# Altium project AC Measure Monitor Senso Board.PrjPcb
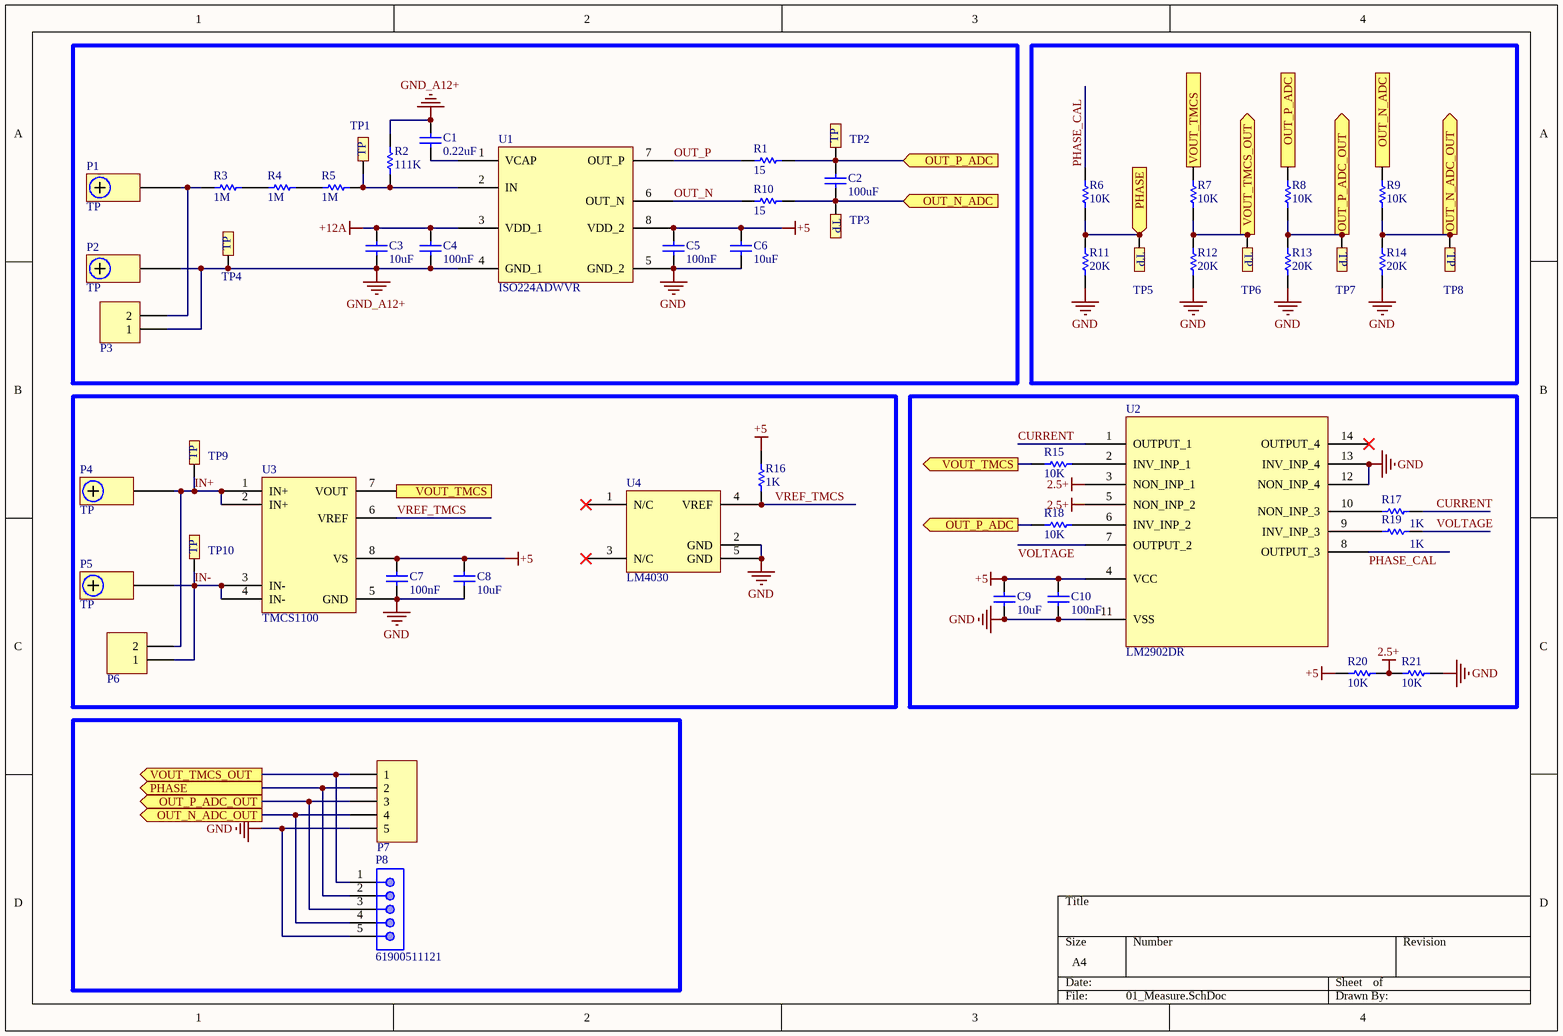
[diagram p0: 01_Measure.SchDoc]
3 sheets, 105 parts. Net scope: flat (ports and power ports of the same name join across sheets).
Board file: MeasurePCB.PcbDoc
Sheets:
  01_Measure.SchDoc
  02_MCU_Interface.SchDoc
  03_Power_Supply.SchDoc

## Sheet 01_Measure.SchDoc
size A4

### Parts
(Parts that share a designator on the sheet are numbered #1, #2 ... from top to bottom, then left to right.)
C1  value 0.22uF  [CAP-SM-0805]  (hidden comment: Cap Non-Pol SMD)
C2  value 100uF  [CAP-SM-1210]  (hidden comment: Cap Non-Pol SMD)
C3  value 10uF  [CAP-SM-0805]  (hidden comment: Cap Non-Pol SMD)
C4  value 100nF  [CAP-SM-0805]  (hidden comment: Cap Non-Pol SMD)
C5  value 100nF  [CAP-SM-0805]  (hidden comment: Cap Non-Pol SMD)
C6  value 10uF  [CAP-SM-0805]  (hidden comment: Cap Non-Pol SMD)
C7  value 100nF  [CAP-SM-0805]  (hidden comment: Cap Non-Pol SMD)
C8  value 10uF  [CAP-SM-0805]  (hidden comment: Cap Non-Pol SMD)
C9#1  value 10uF  [CAP-SM-0603]  (hidden comment: Cap Non-Pol SMD)
C10#1  value 100nF  [CAP-SM-0603]  (hidden comment: Cap Non-Pol SMD)
P1  TP  [TP]
P2  TP  [TP]
P3  Domino 2  [DOMINO 2- 5mm]  (value not drawn)
P4  TP  [TP]
P5#1  TP  [TP]
P6#1  Domino 2  [DOMINO 2- 5mm]  (value not drawn)
P7#1  Header 5  [JP5]  (value not drawn)
P8#1  61900511121  [61900511121]
R1  value 15  [RES-SM-1206]  (hidden comment: RESISTOR SMD)
R2  value 111K  [RES-SM-1206]  (hidden comment: RESISTOR SMD)
R3  value 1M  [RES-SM-1206]  (hidden comment: RESISTOR SMD)
R4  value 1M  [RES-SM-1206]  (hidden comment: RESISTOR SMD)
R5  value 1M  [RES-SM-1206]  (hidden comment: RESISTOR SMD)
R6  value 10K  [RES-SM-0603]  (hidden comment: RESISTOR SMD)
R7  value 10K  [RES-SM-0603]  (hidden comment: RESISTOR SMD)
R8  value 10K  [RES-SM-0603]  (hidden comment: RESISTOR SMD)
R9  value 10K  [RES-SM-0603]  (hidden comment: RESISTOR SMD)
R10  value 15  [RES-SM-1206]  (hidden comment: RESISTOR SMD)
R11  value 20K  [RES-SM-0603]  (hidden comment: RESISTOR SMD)
R12  value 20K  [RES-SM-0603]  (hidden comment: RESISTOR SMD)
R13  value 20K  [RES-SM-0603]  (hidden comment: RESISTOR SMD)
R14#1  value 20K  [RES-SM-0603]  (hidden comment: RESISTOR SMD)
R15#1  value 10K  [RES-SM-0603]  (hidden comment: RESISTOR SMD)
R16#1  value 1K  [RES-SM-0603]  (hidden comment: RESISTOR SMD)
R17#1  value 1K  [RES-SM-0603]  (hidden comment: RESISTOR SMD)
R18#1  value 10K  [RES-SM-0603]  (hidden comment: RESISTOR SMD)
R19#1  value 1K  [RES-SM-0603]  (hidden comment: RESISTOR SMD)
R20#1  value 10K  [RES-SM-0603]  (hidden comment: RESISTOR SMD)
R21#1  value 10K  [RES-SM-0603]  (hidden comment: RESISTOR SMD)
TP1  Test Point  [TP]  (value not drawn)
TP2  Test Point  [TP]  (value not drawn)
TP3  Test Point  [TP]  (value not drawn)
TP4  Test Point  [TP]  (value not drawn)
TP5  Test Point  [TP]  (value not drawn)
TP6  Test Point  [TP]  (value not drawn)
TP7  Test Point  [TP]  (value not drawn)
TP8  Test Point  [TP]  (value not drawn)
TP9  Test Point  [TP]  (value not drawn)
TP10#1  Test Point  [TP]  (value not drawn)
U1  ISO224ADWVR  [SOIC127P1150X280-8N]
U2  LM2902DR  [SOIC127P600X175-14N]
U3  TMCS1100  [SOIC127P650X175-8N]
U4#1  LM4030  [SOT95P279X130-5N]

### Ports
OUT_N_ADC (in), OUT_N_ADC (out), OUT_N_ADC_OUT (out), OUT_P_ADC (in), OUT_P_ADC (out), OUT_P_ADC_OUT (out), PHASE (in), PHASE (out), VOUT_TMCS (in), VOUT_TMCS (out), VOUT_TMCS_OUT (out)

### Nets
2.5+: R20#1.1 R21#1.2 U2.3(NON_INP_1) U2.5(NON_INP_2)
+5: C5.2 C6.2 C7.2 C8.2 C9#1.2 C10#1.1 R16#1.2 R20#1.2 U1.8(VDD_2) U2.4(VCC) U3.8(VS)
+12A: C3.2 C4.2 U1.3(VDD_1)
GND: C5.1 C6.1 C7.1 C8.1 C9#1.1 C10#1.2 P7#1.5 P8#1.5 R11.1 R12.1 R13.1 R14#1.1 R21#1.1 U1.5(GND_2) U2.11(VSS) U2.12(NON_INP_4) U2.13(INV_INP_4) U3.5(GND) U4#1.2(GND) U4#1.5(GND)
GND_A12+: C1.2 C3.1 C4.1 P2.1 P3.1 R2.2 TP4.TP1 U1.4(GND_1)
CURRENT: R17#1.1 U2.1(OUTPUT_1)
IN+: P4.1 P6#1.2 TP9.TP1 U3.1(IN+) U3.2(IN+)
IN-: P5#1.1 P6#1.1 TP10#1.TP1 U3.3(IN-) U3.4(IN-)
OUT_N: R10.1 U1.6(OUT_N)
OUT_P: R1.1 U1.7(OUT_P)
PHASE_CAL: R6.2 U2.8(OUTPUT_3)
VOLTAGE: R19#1.1 U2.7(OUTPUT_2)
VREF_TMCS: R16#1.1 U3.6(VREF) U4#1.4(VREF)
NetC1_1: C1.1 U1.1(VCAP)
NetC2_1: C2.1 R9.2 R10.2 TP3.TP1 ; port OUT_N_ADC
NetC2_2: C2.2 R1.2 R8.2 R18#1.2 TP2.TP1 ; port OUT_P_ADC
NetP1_1: P1.1 P3.2 R3.1
NetP7#1_1: P7#1.1 P8#1.1 R7.1 R12.2 TP6.TP1 ; port VOUT_TMCS_OUT
NetP7#1_2: P7#1.2 P8#1.2 R6.1 R11.2 TP5.TP1 ; port PHASE
NetP7#1_3: P7#1.3 P8#1.3 R8.1 R13.2 TP7.TP1 ; port OUT_P_ADC_OUT
NetP7#1_4: P7#1.4 P8#1.4 R9.1 R14#1.2 TP8.TP1 ; port OUT_N_ADC_OUT
NetR2_1: R2.1 R5.2 TP1.TP1 U1.2(IN)
NetR3_2: R3.2 R4.1
NetR4_2: R4.2 R5.1
NetR7_2: R7.2 R15#1.1 U3.7(VOUT) ; port VOUT_TMCS
NetR15#1_2: R15#1.2 U2.2(INV_INP_1)
NetR17#1_2: R17#1.2 U2.10(NON_INP_3)
NetR18#1_1: R18#1.1 U2.6(INV_INP_2)
NetR19#1_2: R19#1.2 U2.9(INV_INP_3)

Not connected (* = marked no-connect by the designer): U2 14(OUTPUT_4)*; U4#1 1(N/C)* 3(N/C)*

### Notes on the sheet
- (in symbol Test Point) TP

### Library data of the parts
C1-C8 C9#1 C10#1 = Cap Non-Pol SMD: Capacitor
P3 P6#1 = Domino 2: Domino, 2-Pin; LatestRevisionDate: 17-Jul-2002; LatestRevisionNote: Re-released for DXP Platform.; Publisher: Altium Limited
P7#1 = Header 5: Header, 5-Pin; LatestRevisionDate: 17-Jul-2002; LatestRevisionNote: Re-released for DXP Platform.; Publisher: Altium Limited
P8#1 = 61900511121: WR-WTB THT Male Vertical Locking Header, pitch 2.54mm, 5p; Pin Number: 5; Contact Resistance: 20mOhm; Rated Current: 3A; Withstanding Voltage: 1000VAC; Working Voltage: 250VAC; ComponentLink1Description: Manufacturer; ComponentLink1URL: http://www.we-online.de; ComponentLink2Description: Datasheet; ComponentLink2URL: https://www.we-online.com/catalog/datasheet/61900511121.pdf; Pitch: 2.54mm; Published Date: January 2020; Publisher: Wurth Elektronik; Mounting Technology: THT; Packaging: Bag; Operating Temperature: -40 to +105degC; Part Number: 61900511121; Gender: Male; Type: Vertical
R1-R13 R14#1 R15#1 R16#1 R17#1 R18#1 R19#1 R20#1 R21#1 = RESISTOR SMD: Resistor
U1 = ISO224ADWVR: Manufacturer: Texas Instruments; ComponentLink1Description: Supplier 1 Link; Supplier 1: Mouser; ComponentLink1URL: https://www.mouser.vn/ProductDetail/Texas-Instruments/ISO224ADWV?qs=%252BEew9%252B0nqrAIOtaYYgHDyw%3D%3D; Manufacturer P/N: ISO224ADWV; Supplier 1 P/N: 595-ISO224ADWV
U3 = TMCS1100: Manufacturer: Texas Instruments; Manufacturer P/N: TMCS1100A1QD; ComponentLink1Description: Supplier 1 Link; Supplier 1: Mouser; ComponentLink1URL: https://www.mouser.vn/ProductDetail/Texas-Instruments/TMCS1100A1QDR?qs=sPbYRqrBIVm7HRwTfsNKdw%3D%3D; Supplier 1 P/N: 595-TMCS1100A1QDR
U4#1 = LM4030: Manufacturer: Texas Instruments; Manufacturer P/N: LM4030BMF-2.5/NOPB; ComponentLink1Description: Supplier 1 Link; ComponentLink1URL: https://www.mouser.vn/ProductDetail/Texas-Instruments/LM4030BMF-25-NOPB?qs=QbsRYf82W3GjKEoF5S%2FJEg%3D%3D; Supplier 1: Mouser; Supplier 1 P/N: 926-LM4030BMF25NOPB
P1 P2 P4 P5#1 = TP: ComponentLink1Description: Supplier 1 Link

## Sheet 02_MCU_Interface.SchDoc
size A4
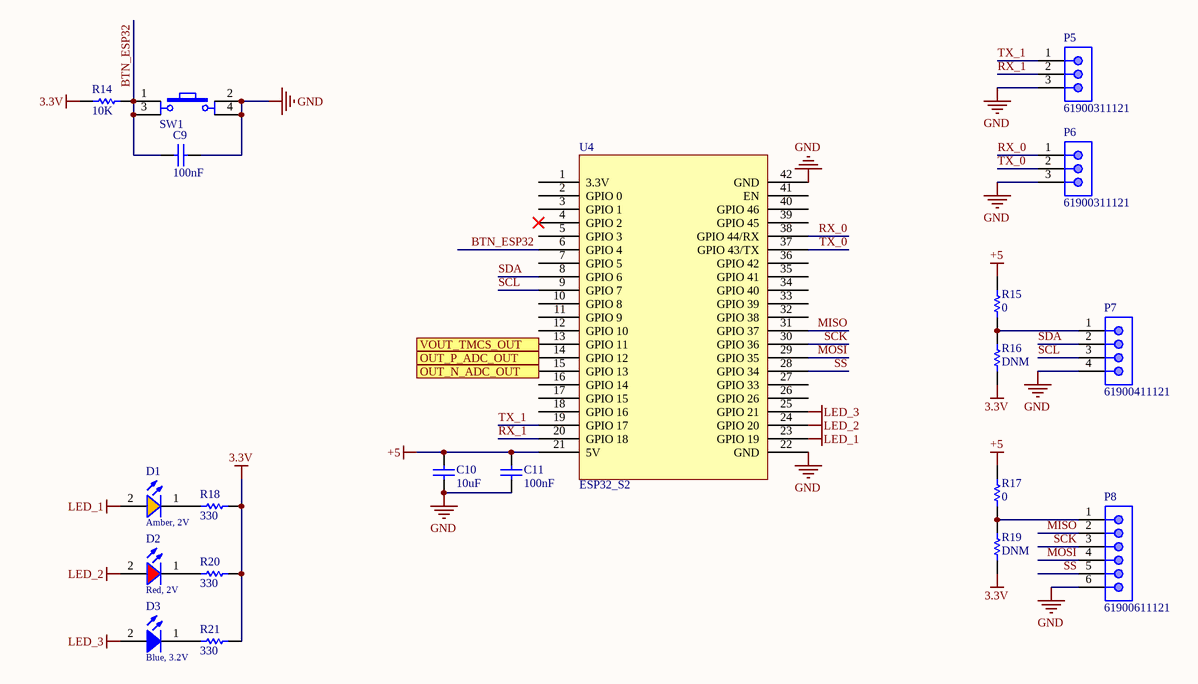
[diagram p1: 02_MCU_Interface.SchDoc]

### Parts
(Parts that share a designator on the sheet are numbered #1, #2 ... from top to bottom, then left to right.)
C9#2  value 100nF  [CAP-SM-0805]  (hidden comment: Cap Non-Pol SMD)
C10#2  value 10uF  [CAP-SM-0805]  (hidden comment: Cap Non-Pol SMD)
C11  value 100nF  [CAP-SM-0805]  (hidden comment: Cap Non-Pol SMD)
D1  Amber, 2V  [WL-SMCW_0603_H=0.7mm]
D2  Red, 2V  [WL-SMCW_0603_H=0.7mm]
D3  Blue, 3.2V  [WL-SMCW_0603_H=0.7mm]
P5#2  61900311121  [61900311121]
P6#2  61900311121  [61900311121]
P7#2  61900411121  [61900411121]
P8#2  61900611121  [61900611121]
R14#2  value 10K  [RES 1/2W]  (hidden comment: RESISTOR)
R15#2  value 0  [RES-SM-0603]  (hidden comment: RESISTOR SMD)
R16#2  value DNM  [RES-SM-0603]  (hidden comment: RESISTOR SMD)
R17#2  value 0  [RES-SM-0603]  (hidden comment: RESISTOR SMD)
R18#2  value 330  [RES-SM-0603]  (hidden comment: RESISTOR SMD)
R19#2  value DNM  [RES-SM-0603]  (hidden comment: RESISTOR SMD)
R20#2  value 330  [RES-SM-0603]  (hidden comment: RESISTOR SMD)
R21#2  value 330  [RES-SM-0603]  (hidden comment: RESISTOR SMD)
SW1  SW  [Tact SW 4 pin]  (value not drawn)
U4#2  ESP32_S2  [ESP32_S2]

### Ports
OUT_N_ADC_OUT (in), OUT_P_ADC_OUT (in), VOUT_TMCS_OUT (in)

### Nets
3.3V: R14#2.1 R16#2.1 R18#2.2 R19#2.1 R20#2.2 R21#2.2
+5: C10#2.1 C11.1 R15#2.2 R17#2.2 U4#2.21(5V)
GND: C9#2.2 C10#2.2 C11.2 P5#2.3 P6#2.3 P7#2.4 P8#2.6 SW1.2 SW1.4 U4#2.22(GND) U4#2.42(GND)
LED_1: D1.2(A) U4#2.23(GPIO_19)
LED_2: D2.2(A) U4#2.24(GPIO_20)
LED_3: D3.2(A) U4#2.25(GPIO_21)
BTN_ESP32: C9#2.1 R14#2.2 SW1.1 SW1.3 U4#2.6(GPIO_4)
MISO: P8#2.2 U4#2.31(GPIO_37)
MOSI: P8#2.4 U4#2.29(GPIO_35)
RX_0: P6#2.1 U4#2.38(GPIO_44/RX)
RX_1: P5#2.2 U4#2.20(GPIO_18)
SCK: P8#2.3 U4#2.30(GPIO_36)
SCL: P7#2.3 U4#2.9(GPIO_7)
SDA: P7#2.2 U4#2.8(GPIO_6)
SS: P8#2.5 U4#2.28(GPIO_34)
TX_0: P6#2.2 U4#2.37(GPIO_43/TX)
TX_1: P5#2.1 U4#2.19(GPIO_17)
NetD1_1: D1.1(K) R18#2.1
NetD2_1: D2.1(K) R20#2.1
NetD3_1: D3.1(K) R21#2.1
NetP7#1_1: U4#2.13(GPIO_11) ; port VOUT_TMCS_OUT
NetP7#1_3: U4#2.14(GPIO_12) ; port OUT_P_ADC_OUT
NetP7#1_4: U4#2.15(GPIO_13) ; port OUT_N_ADC_OUT
NetP7#2_1: P7#2.1 R15#2.1 R16#2.2
NetP8#2_1: P8#2.1 R17#2.1 R19#2.2

Not connected (* = marked no-connect by the designer): U4#2 1(3.3V) 2(GPIO_0) 3(GPIO_1) 4(GPIO_2)* 5(GPIO_3) 7(GPIO_5) 10(GPIO_8) 11(GPIO_9) 12(GPIO_10) 16(GPIO_14) 17(GPIO_15) 18(GPIO_16) 26(GPIO_26) 27(GPIO_33) 32(GPIO_38) 33(GPIO_39) 34(GPIO_40) 35(GPIO_41) 36(GPIO_42) 39(GPIO_45) 40(GPIO_46) 41(EN)

### Library data of the parts
C9#2 C10#2 C11 = Cap Non-Pol SMD: Capacitor
D1 = 150060AS75000: WL-SMCW SMT Mono-color Chip LED Waterclear, size 0603, Amber, 2V, 140deg; Chip Technology: AlInGaP; Dominant Wavelength typ.: 605nm; Luminous Intensity typ.: 130mcd; Peak Wavelength typ.: 610nm; Viewing Angle: 140deg; ComponentLink1Description: Manufacturer; ComponentLink1URL: http://www.we-online.de; ComponentLink2URL: https://www.we-online.com/catalog/datasheet/150060AS75000.pdf; ComponentLink2Description: Datasheet; Forward Voltage typ.: 2V; Emitting Color: Amber; Mounting Technology: SMT; Operating Temperature: -40 to +85degC; Published Date: December 2019; Part Number: 150060AS75000; Packaging: Tape and Reel; Size: 0603; Publisher: Wurth Elektronik
D2 = 150060RS75000: WL-SMCW SMT Mono-color Chip LED Waterclear, size 0603, Red, 2V, 140deg; Chip Technology: AlInGaP; Dominant Wavelength typ.: 625nm; Luminous Intensity typ.: 250mcd; Peak Wavelength typ.: 630nm; Viewing Angle: 140deg; ComponentLink1Description: Manufacturer; ComponentLink1URL: http://www.we-online.de; ComponentLink2URL: https://www.we-online.com/catalog/datasheet/150060RS75000.pdf; ComponentLink2Description: Datasheet; Forward Voltage typ.: 2V; Emitting Color: Red; Mounting Technology: SMT; Operating Temperature: -40 to +85degC; Published Date: December 2019; Part Number: 150060RS75000; Packaging: Tape and Reel; Size: 0603; Publisher: Wurth Elektronik
D3 = 150060BS75000: WL-SMCW SMT Mono-color Chip LED Waterclear, size 0603, Blue, 3.2V, 140deg; Chip Technology: InGaN; Dominant Wavelength typ.: 470nm; Luminous Intensity typ.: 145mcd; Peak Wavelength typ.: 465nm; Viewing Angle: 140deg; ComponentLink1Description: Manufacturer; ComponentLink1URL: http://www.we-online.de; ComponentLink2URL: https://www.we-online.com/catalog/datasheet/150060BS75000.pdf; ComponentLink2Description: Datasheet; Forward Voltage typ.: 3.2V; Emitting Color: Blue; Mounting Technology: SMT; Operating Temperature: -40 to +85degC; Published Date: December 2019; Part Number: 150060BS75000; Packaging: Tape and Reel; Size: 0603; Publisher: Wurth Elektronik
P5#2 P6#2 = 61900311121: WR-WTB THT Male Vertical Locking Header, pitch 2.54mm, 3p; Pin Number: 3; Contact Resistance: 20mOhm; Rated Current: 3A; Withstanding Voltage: 1000VAC; Working Voltage: 250VAC; ComponentLink1Description: Manufacturer; ComponentLink1URL: http://www.we-online.de; ComponentLink2Description: Datasheet; ComponentLink2URL: https://www.we-online.com/catalog/datasheet/61900311121.pdf; Pitch: 2.54mm; Published Date: January 2020; Publisher: Wurth Elektronik; Mounting Technology: THT; Packaging: Bag; Operating Temperature: -40 to +105degC; Part Number: 61900311121; Gender: Male; Type: Vertical
P7#2 = 61900411121: WR-WTB THT Male Vertical Locking Header, pitch 2.54mm, 4p; Pin Number: 4; Contact Resistance: 20mOhm; Rated Current: 3A; Withstanding Voltage: 1000VAC; Working Voltage: 250VAC; ComponentLink1Description: Manufacturer; ComponentLink1URL: http://www.we-online.de; ComponentLink2Description: Datasheet; ComponentLink2URL: https://www.we-online.com/catalog/datasheet/61900411121.pdf; Pitch: 2.54mm; Published Date: January 2020; Publisher: Wurth Elektronik; Mounting Technology: THT; Packaging: Bag; Operating Temperature: -40 to +105degC; Part Number: 61900411121; Gender: Male; Type: Vertical
P8#2 = 61900611121: WR-WTB THT Male Vertical Locking Header, pitch 2.54mm, 6p; Pin Number: 6; Contact Resistance: 20mOhm; Rated Current: 3A; Withstanding Voltage: 1000VAC; Working Voltage: 250VAC; ComponentLink1Description: Manufacturer; ComponentLink1URL: http://www.we-online.de; ComponentLink2Description: Datasheet; ComponentLink2URL: https://www.we-online.com/catalog/datasheet/61900611121.pdf; Pitch: 2.54mm; Published Date: January 2020; Publisher: Wurth Elektronik; Mounting Technology: THT; Packaging: Bag; Operating Temperature: -40 to +105degC; Part Number: 61900611121; Gender: Male; Type: Vertical
R15#2 R16#2 R17#2 R18#2 R19#2 R20#2 R21#2 = RESISTOR SMD: Resistor
SW1 = Tact SW - 4Pin: Switch button 4 pin; Value: Button chip 4 pin

## Sheet 03_Power_Supply.SchDoc
size A4
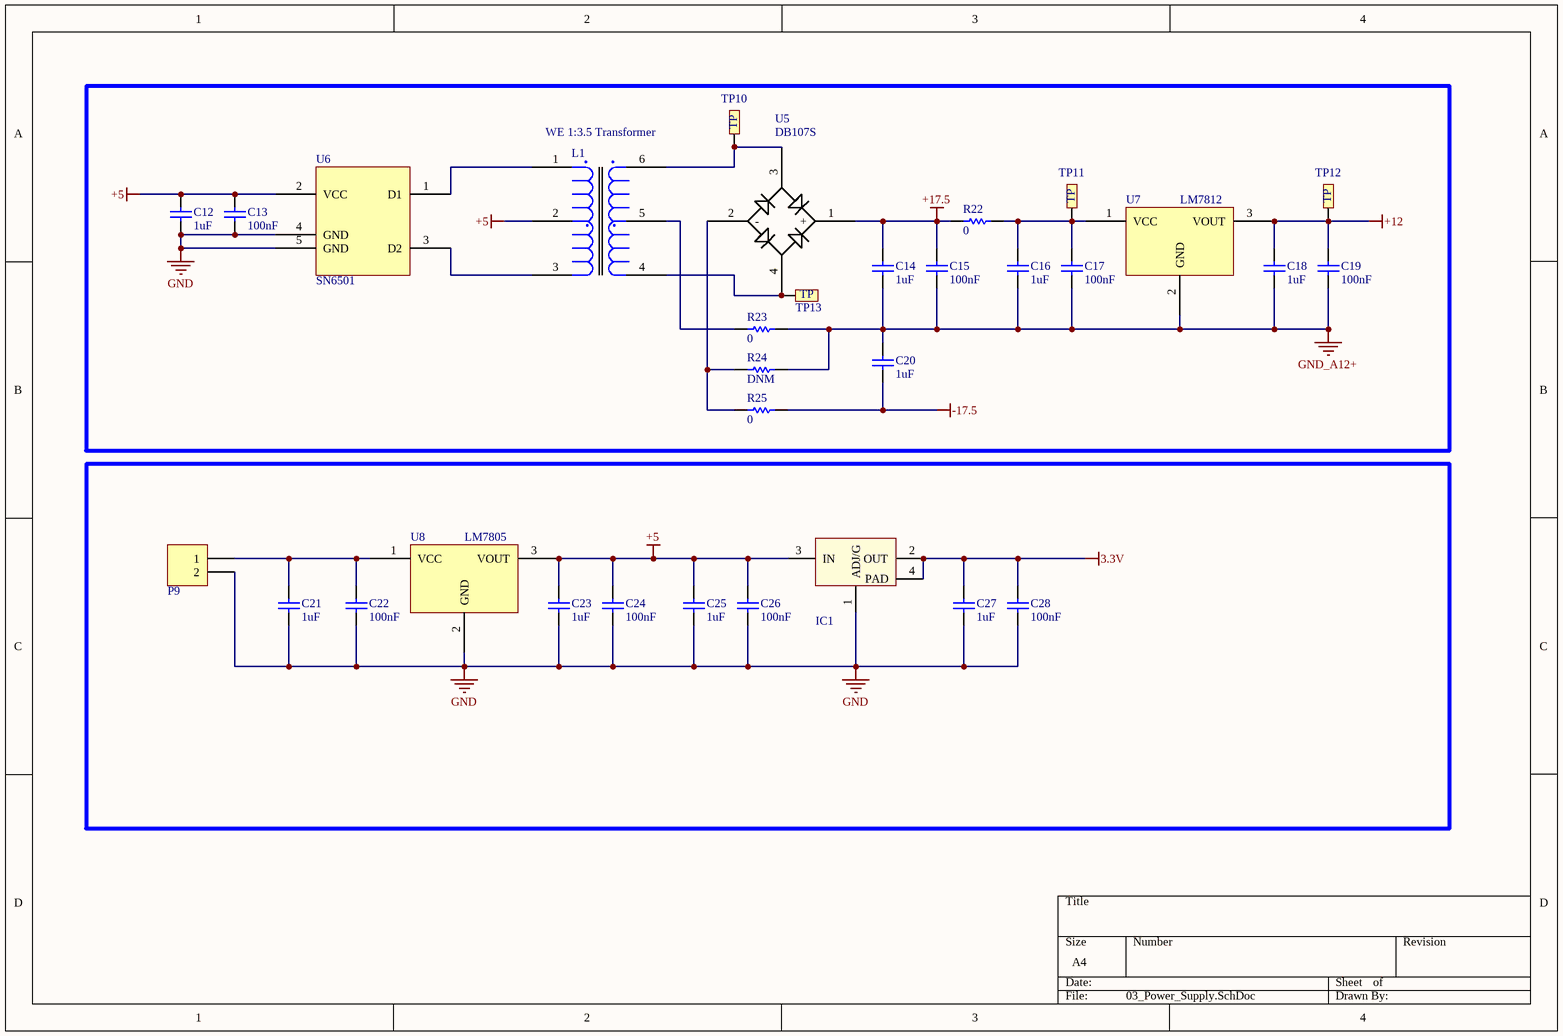
[diagram p2: 03_Power_Supply.SchDoc]

### Parts
(Parts that share a designator on the sheet are numbered #1, #2 ... from top to bottom, then left to right.)
C12  value 1uF  [CAP-SM-0805]  (hidden comment: Cap Non-Pol SMD)
C13  value 100nF  [CAP-SM-0805]  (hidden comment: Cap Non-Pol SMD)
C14  value 1uF  [CAP-SM-0805]  (hidden comment: Cap Non-Pol SMD)
C15  value 100nF  [CAP-SM-0805]  (hidden comment: Cap Non-Pol SMD)
C16  value 1uF  [CAP-SM-0805]  (hidden comment: Cap Non-Pol SMD)
C17  value 100nF  [CAP-SM-0805]  (hidden comment: Cap Non-Pol SMD)
C18  value 1uF  [CAP-SM-0805]  (hidden comment: Cap Non-Pol SMD)
C19  value 100nF  [CAP-SM-0805]  (hidden comment: Cap Non-Pol SMD)
C20  value 1uF  [CAP-SM-0805]  (hidden comment: Cap Non-Pol SMD)
C21  value 1uF  [CAP-SM-0805]  (hidden comment: Cap Non-Pol SMD)
C22  value 100nF  [CAP-SM-0805]  (hidden comment: Cap Non-Pol SMD)
C23  value 1uF  [CAP-SM-0805]  (hidden comment: Cap Non-Pol SMD)
C24  value 100nF  [CAP-SM-0805]  (hidden comment: Cap Non-Pol SMD)
C25  value 1uF  [CAP-SM-0805]  (hidden comment: Cap Non-Pol SMD)
C26  value 100nF  [CAP-SM-0805]  (hidden comment: Cap Non-Pol SMD)
C27  value 1uF  [CAP-SM-0805]  (hidden comment: Cap Non-Pol SMD)
C28  value 100nF  [CAP-SM-0805]  (hidden comment: Cap Non-Pol SMD)
IC1  LM1117  [SOT223-4N]  (value not drawn)
L1  WE 1:3.5 Transformer  [750316818]
P9  Domino 2  [DOMINO 2- 5mm]  (value not drawn)
R22  value 0  [RES-SM-1206]  (hidden comment: RESISTOR SMD)
R23  value 0  [RES-SM-1206]  (hidden comment: RESISTOR SMD)
R24  value DNM  [RES-SM-1206]  (hidden comment: RESISTOR SMD)
R25  value 0  [RES-SM-1206]  (hidden comment: RESISTOR SMD)
TP10#2  Test Point  [TP]  (value not drawn)
TP11  Test Point  [TP]  (value not drawn)
TP12  Test Point  [TP]  (value not drawn)
TP13  Test Point  [TP]  (value not drawn)
U5  DB107S  [SOT510P990X365-4N]
U6  SN6501  [SOT95P280X145-5N]
U7  LM7812  [DPAK228P1014X239-3N]
U8  LM7805  [DPAK228P1014X239-3N]

### Nets
3.3V: C27.2 C28.2 IC1.2(OUT) IC1.4(PAD)
+5: C12.2 C13.2 C23.2 C24.2 C25.2 C26.2 IC1.3(IN) L1.2 U6.2(VCC) U8.3(VOUT)
+12: C18.2 C19.2 TP12.TP1 U7.3(VOUT)
+17.5: C14.2 C15.2 R22.1 U5.1(+)
-17.5: C20.1 R25.1
GND: C12.1 C13.1 C21.1 C22.1 C23.1 C24.1 C25.1 C26.1 C27.1 C28.1 IC1.1(ADJ/G) P9.2 U6.4(GND) U6.5(GND) U8.2(GND)
GND_A12+: C14.1 C15.1 C16.1 C17.1 C18.1 C19.1 C20.2 R23.2 R24.2 U7.2(GND)
NetC16_2: C16.2 C17.2 R22.2 TP11.TP1 U7.1(VCC)
NetC21_2: C21.2 C22.2 P9.1 U8.1(VCC)
NetL1_1: L1.1 U6.1(D1)
NetL1_3: L1.3 U6.3(D2)
NetL1_4: L1.4 TP13.TP1 U5.4
NetL1_5: L1.5 R23.1
NetL1_6: L1.6 TP10#2.TP1 U5.3
NetR24_1: R24.1 R25.2 U5.2(-)

### Notes on the sheet
- (in symbol Test Point) TP

### Library data of the parts
C12-C28 = Cap Non-Pol SMD: Capacitor
IC1 = LM1117: Available in 1.8V, 2.5V, 2.85V, 3.3V, 5V, and  Adjustable Versions; Value: LM317
L1 = WE 1:3.5 Transformer: Manufacturer: Wurth Elektronik; ComponentLink1Description: Supplier 1 Link; ComponentLink1URL: https://www.mouser.vn/ProductDetail/Wurth-Elektronik/750316818?qs=%2Fha2pyFaduhwWLO%2FwuaxPfkbn2Vm0sf%2F6JG8uX8izSO8%2FxDOwuQ00g%3D%3D; Manufacturer P/N: 750316818; Supplier 1: Mouser; Supplier 1 P/N: 710-750316818
P9 = Domino 2: Domino, 2-Pin; LatestRevisionDate: 17-Jul-2002; LatestRevisionNote: Re-released for DXP Platform.; Publisher: Altium Limited
R22-R25 = RESISTOR SMD: Resistor
U7 U8 = LM78xx

## Nets that join several sheets
3.3V: 02_MCU_Interface (6 pins), 03_Power_Supply (C27.2 C28.2 IC1.2 IC1.4)
+5: 01_Measure (11 pins), 02_MCU_Interface (5 pins), 03_Power_Supply (10 pins)
GND: 01_Measure (20 pins), 02_MCU_Interface (11 pins), 03_Power_Supply (15 pins)
GND_A12+: 01_Measure (8 pins), 03_Power_Supply (10 pins)
NetP7#1_1: 01_Measure (5 pins), 02_MCU_Interface (U4#2.13)
NetP7#1_3: 01_Measure (5 pins), 02_MCU_Interface (U4#2.14)
NetP7#1_4: 01_Measure (5 pins), 02_MCU_Interface (U4#2.15)